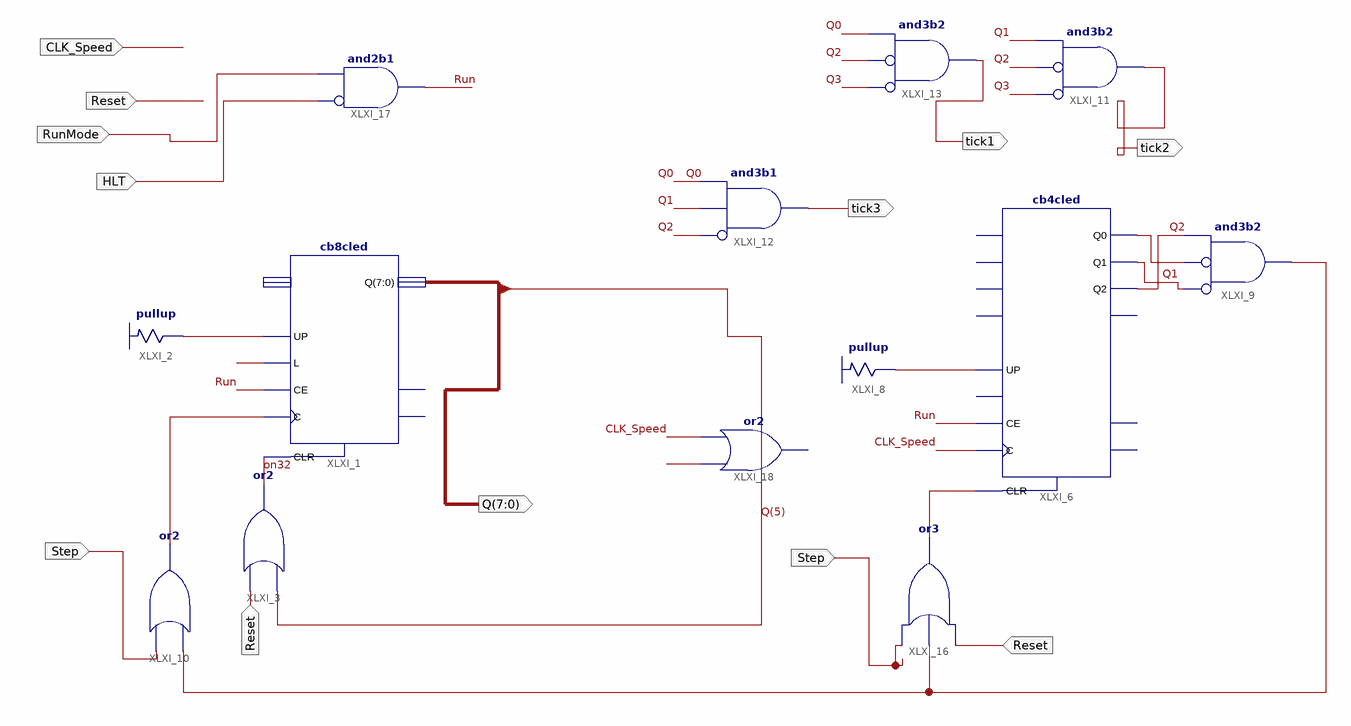
[diagram p0: schematic sheet 1]
// Xilinx ISE schematic P_Counter.sch (spartan3e) as structural Verilog: 13 symbols, 9 ports
module P_Counter (
  input  CLK_Speed,
  input  Step,
  input  Reset,
  input  HLT,
  input  RunMode,
  output [7:0] Q,
  output tick1,
  output tick2,
  output tick3
);

  wire on32, Q0, Q1, Q2, Q3, Run, XLXN_3, XLXN_4, XLXN_17, XLXN_18, XLXN_21, XLXN_25, XLXN_27;

  cb8cled XLXI_1 (.C(XLXN_18), .CE(Run), .CLR(on32), .L(XLXN_4), .UP(XLXN_3), .Q(Q));  // open: D, CEO, TC
  \pullup  XLXI_2 (.O(XLXN_3));
  or XLXI_3 (on32, Q[5], Reset);
  cb4cled XLXI_6 (
    .C(CLK_Speed), .CE(Run), .CLR(XLXN_25), .UP(XLXN_17), .Q0(Q0), .Q1(Q1), .Q2(Q2));  // open: D0, D1, D2, D3, L, CEO, Q3, TC
  \pullup  XLXI_8 (.O(XLXN_17));
  and XLXI_9 (XLXN_21, ~Q1, ~Q0, Q2);  // and3b2
  or XLXI_10 (XLXN_18, XLXN_21, Step);
  and XLXI_11 (tick2, ~Q3, ~Q2, Q1);  // and3b2
  and XLXI_13 (tick1, ~Q3, ~Q2, Q0);  // and3b2
  and XLXI_12 (tick3, ~Q2, Q1, Q0);  // and3b1
  or XLXI_16 (XLXN_25, Reset, XLXN_21, Step);
  and XLXI_17 (Run, ~HLT, RunMode);  // and2b1
  // or2 XLXI_18 has open pins: I0=XLXN_27, I1=CLK_Speed, O=open
endmodule
